# Altium project HPBIController.PrjPCB (part 4 of 8)

## Sheet DDR3A.SchDoc: 02290_Sonoma_Controller
size B; ApprovedBy: J Johnson; CheckedBy: J Johnson; Author: sdfasdfdfAEFfasdFfaF; DrawnBy: J Johnson; Organization: Opsero Electronic Design; Address1: 21-915 Av. Marguerite-Bourgeoys; Address2: Québec (QC); Address3: G1S 3X4; DocumentNumber: OP009-001-SCH; Revision: D-1; SheetNumber: 03; SheetTotal: 16; Tel1: (581) 308-8830; Tel2: (581) 308-8830; Project: 02290_Sonoma_Controller; CheckedDate: 2013-12-13; Sheet: DDR3 SDRAM Page 1; PageSetup: Record=PageOptions|CenterHorizontal=True|CenterVertical=True|PrintScale=1.08|XCorrection=1.00|YCorrection=1.00|PrintKind=0|BorderSize=5000000|LeftOffset=0|BottomOffset=0|Orientation=2|PaperLength=1000|PaperWidth=1000|Scale=100|PaperSource=7|PrintQuality=-4|MediaType=1|DitherType=10|PaperKind=Tabloid     [11 x 17 in]|PrintScaleMode=1; DrawDate: 2013-12-13; SchTitle: 02290_Sonoma_Controller; RevDescription: Replaced Q2,Q3 with STD16NF06LT4; RevDate: 2020-07-07; RevBy: J Johnson; RevDescription2: Added resistors to QSPI interface; ModifiedDate: 2020-07-07
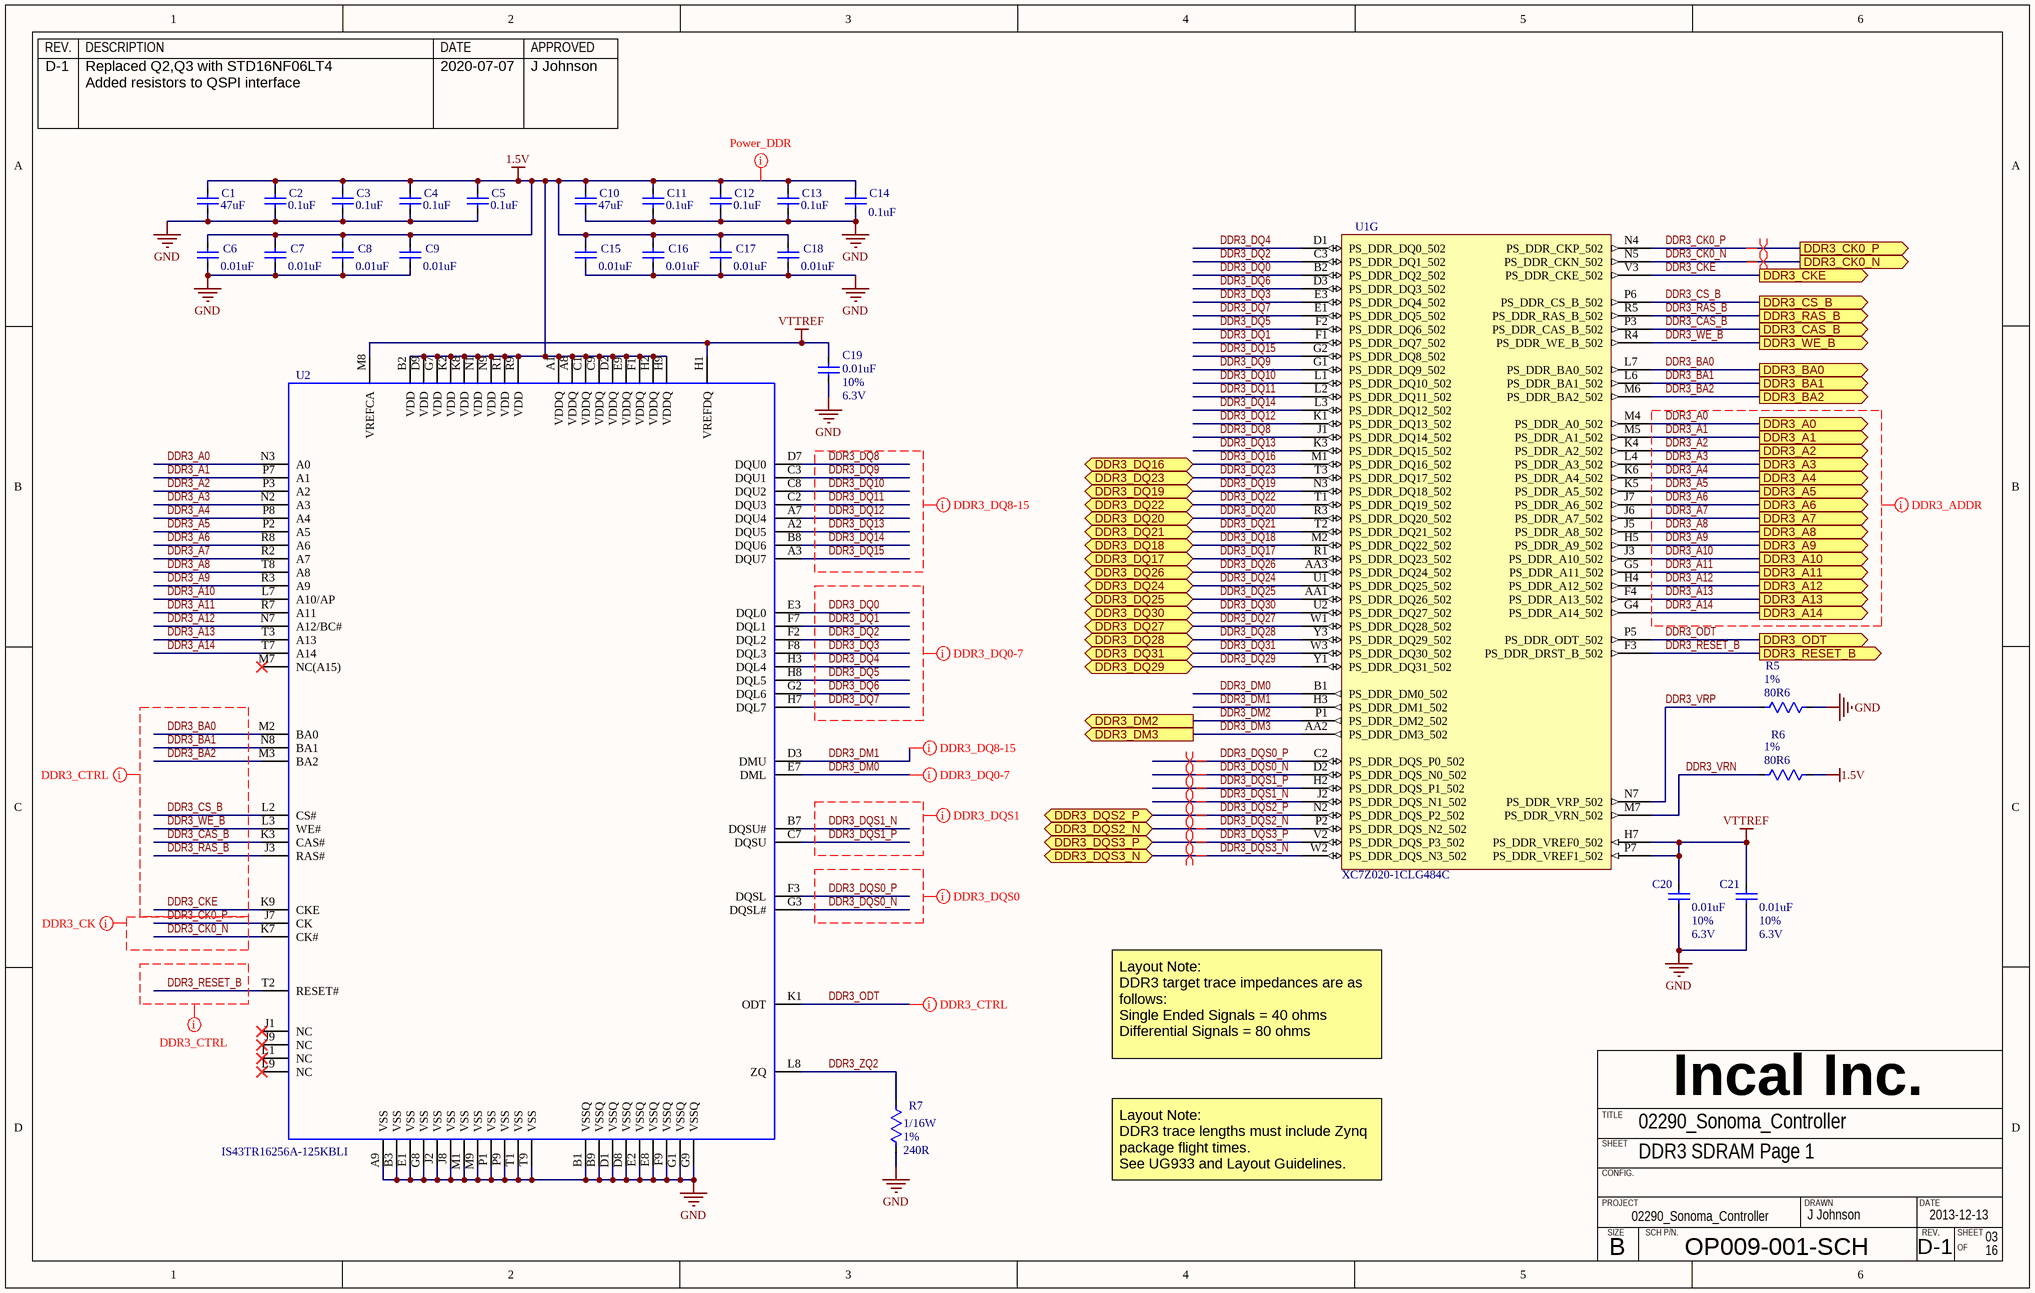
[diagram p5: DDR3A.SchDoc]

### Parts
C1  value 47uF  [CAPC2013X125N]  (hidden comment: CAPACITOR_NP_TYPE1)
C2  value 0.1uF  [CAPC0603X33N]  (hidden comment: CAPACITOR_NP_TYPE1)
C3  value 0.1uF  [CAPC0603X33N]  (hidden comment: CAPACITOR_NP_TYPE1)
C4  value 0.1uF  [CAPC0603X33N]  (hidden comment: CAPACITOR_NP_TYPE1)
C5  value 0.1uF  [CAPC0603X33N]  (hidden comment: CAPACITOR_NP_TYPE1)
C6  value 0.01uF  [CAPC0603X33N]  (hidden comment: CAPACITOR_NP_TYPE1)
C7  value 0.01uF  [CAPC0603X33N]  (hidden comment: CAPACITOR_NP_TYPE1)
C8  value 0.01uF  [CAPC0603X33N]  (hidden comment: CAPACITOR_NP_TYPE1)
C9  value 0.01uF  [CAPC0603X33N]  (hidden comment: CAPACITOR_NP_TYPE1)
C10  value 47uF  [CAPC2013X125N]  (hidden comment: CAPACITOR_NP_TYPE1)
C11  value 0.1uF  [CAPC0603X33N]  (hidden comment: CAPACITOR_NP_TYPE1)
C12  value 0.1uF  [CAPC0603X33N]  (hidden comment: CAPACITOR_NP_TYPE1)
C13  value 0.1uF  [CAPC0603X33N]  (hidden comment: CAPACITOR_NP_TYPE1)
C14  value 0.1uF  [CAPC0603X33N]  (hidden comment: CAPACITOR_NP_TYPE1)
C15  value 0.01uF  [CAPC0603X33N]  (hidden comment: CAPACITOR_NP_TYPE1)
C16  value 0.01uF  [CAPC0603X33N]  (hidden comment: CAPACITOR_NP_TYPE1)
C17  value 0.01uF  [CAPC0603X33N]  (hidden comment: CAPACITOR_NP_TYPE1)
C18  value 0.01uF  [CAPC0603X33N]  (hidden comment: CAPACITOR_NP_TYPE1)
C19  value 0.01uF  Tolerance: 10%  Voltage: 6.3V  [CAPC0603X33N]  (hidden comment: CAPACITOR_NP_TYPE1)
C20  value 0.01uF  Tolerance: 10%  Voltage: 6.3V  [CAPC0603X33N]  (hidden comment: CAPACITOR_NP_TYPE1)
C21  value 0.01uF  Tolerance: 10%  Voltage: 6.3V  [CAPC0603X33N]  (hidden comment: CAPACITOR_NP_TYPE1)
R5  value 80R6  Tolerance: 1%  [RESC1005X33N]  (hidden comment: *)
R6  value 80R6  Tolerance: 1%  [RESC1005X33N]  (hidden comment: *)
R7  value 240R  Power: 1/16W  Tolerance: 1%  [RESC1005X33N]  (hidden comment: *)
U1  XC7Z020-1CLG484C  [CLG484]  (part G of 10)
U2  IS43TR16256A-125KBLI  [BGA96C80P6X16_900X1300X120]

### Ports
DDR3_A0 (out), DDR3_A1 (out), DDR3_A2 (out), DDR3_A3 (out), DDR3_A4 (out), DDR3_A5 (out), DDR3_A6 (out), DDR3_A7 (out), DDR3_A8 (out), DDR3_A9 (out), DDR3_A10 (out), DDR3_A11 (out), DDR3_A12 (out), DDR3_A13 (out), DDR3_A14 (out), DDR3_BA0 (out), DDR3_BA1 (out), DDR3_BA2 (out), DDR3_CAS_B (out), DDR3_CK0_N (out), DDR3_CK0_P (out), DDR3_CKE (out), DDR3_CS_B (out), DDR3_DM2 (out), DDR3_DM3 (out), DDR3_DQ16 (bidir), DDR3_DQ17 (bidir), DDR3_DQ18 (bidir), DDR3_DQ19 (bidir), DDR3_DQ20 (bidir), DDR3_DQ21 (bidir), DDR3_DQ22 (bidir), DDR3_DQ23 (bidir), DDR3_DQ24 (bidir), DDR3_DQ25 (bidir), DDR3_DQ26 (bidir), DDR3_DQ27 (bidir), DDR3_DQ28 (bidir), DDR3_DQ29 (bidir), DDR3_DQ30 (bidir), DDR3_DQ31 (bidir), DDR3_DQS2_N (bidir), DDR3_DQS2_P (bidir), DDR3_DQS3_N (bidir), DDR3_DQS3_P (bidir), DDR3_ODT (out), DDR3_RAS_B (out), DDR3_RESET_B (out), DDR3_WE_B (out)

### Nets
1.5V: C1.1 C2.1 C3.1 C4.1 C5.1 C6.1 C7.1 C8.1 C9.1 C10.1 C11.1 C12.1 C13.1 C14.1 C15.1 C16.1 C17.1 C18.1 R6.1 U2.A1(VDDQ) U2.A8(VDDQ) U2.B2(VDD) U2.C1(VDDQ) U2.C9(VDDQ) U2.D2(VDDQ) U2.D9(VDD) U2.E9(VDDQ) U2.F1(VDDQ) U2.G7(VDD) U2.H2(VDDQ) U2.H9(VDDQ) U2.K2(VDD) U2.K8(VDD) U2.N1(VDD) U2.N9(VDD) U2.R1(VDD) U2.R9(VDD)
GND: C1.2 C2.2 C3.2 C4.2 C5.2 C6.2 C7.2 C8.2 C9.2 C10.2 C11.2 C12.2 C13.2 C14.2 C15.2 C16.2 C17.2 C18.2 C19.2 C20.2 C21.2 R5.2 R7.1 U2.A9(VSS) U2.B1(VSSQ) U2.B3(VSS) U2.B9(VSSQ) U2.D1(VSSQ) U2.D8(VSSQ) U2.E1(VSS) U2.E2(VSSQ) U2.E8(VSSQ) U2.F9(VSSQ) U2.G1(VSSQ) U2.G8(VSS) U2.G9(VSSQ) U2.J2(VSS) U2.J8(VSS) U2.M1(VSS) U2.M9(VSS) U2.P1(VSS) U2.P9(VSS) U2.T1(VSS) U2.T9(VSS)
VTTREF: C19.1 C20.1 C21.1 U1.H7(PS_DDR_VREF0_502) U1.P7(PS_DDR_VREF1_502) U2.H1(VREFDQ) U2.M8(VREFCA)
DDR3_A0: U1.M4(PS_DDR_A0_502) U2.N3(A0) ; port DDR3_A0
DDR3_A1: U1.M5(PS_DDR_A1_502) U2.P7(A1) ; port DDR3_A1
DDR3_A2: U1.K4(PS_DDR_A2_502) U2.P3(A2) ; port DDR3_A2
DDR3_A3: U1.L4(PS_DDR_A3_502) U2.N2(A3) ; port DDR3_A3
DDR3_A4: U1.K6(PS_DDR_A4_502) U2.P8(A4) ; port DDR3_A4
DDR3_A5: U1.K5(PS_DDR_A5_502) U2.P2(A5) ; port DDR3_A5
DDR3_A6: U1.J7(PS_DDR_A6_502) U2.R8(A6) ; port DDR3_A6
DDR3_A7: U1.J6(PS_DDR_A7_502) U2.R2(A7) ; port DDR3_A7
DDR3_A8: U1.J5(PS_DDR_A8_502) U2.T8(A8) ; port DDR3_A8
DDR3_A9: U1.H5(PS_DDR_A9_502) U2.R3(A9) ; port DDR3_A9
DDR3_A10: U1.J3(PS_DDR_A10_502) U2.L7(A10/AP) ; port DDR3_A10
DDR3_A11: U1.G5(PS_DDR_A11_502) U2.R7(A11) ; port DDR3_A11
DDR3_A12: U1.H4(PS_DDR_A12_502) U2.N7(A12/BC#) ; port DDR3_A12
DDR3_A13: U1.F4(PS_DDR_A13_502) U2.T3(A13) ; port DDR3_A13
DDR3_A14: U1.G4(PS_DDR_A14_502) U2.T7(A14) ; port DDR3_A14
DDR3_BA0: U1.L7(PS_DDR_BA0_502) U2.M2(BA0) ; port DDR3_BA0
DDR3_BA1: U1.L6(PS_DDR_BA1_502) U2.N8(BA1) ; port DDR3_BA1
DDR3_BA2: U1.M6(PS_DDR_BA2_502) U2.M3(BA2) ; port DDR3_BA2
DDR3_CAS_B: U1.P3(PS_DDR_CAS_B_502) U2.K3(CAS#) ; port DDR3_CAS_B
DDR3_CK0_N: U1.N5(PS_DDR_CKN_502) U2.K7(CK#) ; port DDR3_CK0_N
DDR3_CK0_P: U1.N4(PS_DDR_CKP_502) U2.J7(CK) ; port DDR3_CK0_P
DDR3_CKE: U1.V3(PS_DDR_CKE_502) U2.K9(CKE) ; port DDR3_CKE
DDR3_CS_B: U1.P6(PS_DDR_CS_B_502) U2.L2(CS#) ; port DDR3_CS_B
DDR3_DM0: U1.B1(PS_DDR_DM0_502) U2.E7(DML)
DDR3_DM1: U1.H3(PS_DDR_DM1_502) U2.D3(DMU)
DDR3_DM2: U1.P1(PS_DDR_DM2_502) ; port DDR3_DM2
DDR3_DM3: U1.AA2(PS_DDR_DM3_502) ; port DDR3_DM3
DDR3_DQ0: U1.B2(PS_DDR_DQ2_502) U2.E3(DQL0)
DDR3_DQ1: U1.F1(PS_DDR_DQ7_502) U2.F7(DQL1)
DDR3_DQ2: U1.C3(PS_DDR_DQ1_502) U2.F2(DQL2)
DDR3_DQ3: U1.E3(PS_DDR_DQ4_502) U2.F8(DQL3)
DDR3_DQ4: U1.D1(PS_DDR_DQ0_502) U2.H3(DQL4)
DDR3_DQ5: U1.F2(PS_DDR_DQ6_502) U2.H8(DQL5)
DDR3_DQ6: U1.D3(PS_DDR_DQ3_502) U2.G2(DQL6)
DDR3_DQ7: U1.E1(PS_DDR_DQ5_502) U2.H7(DQL7)
DDR3_DQ8: U1.J1(PS_DDR_DQ14_502) U2.D7(DQU0)
DDR3_DQ9: U1.G1(PS_DDR_DQ9_502) U2.C3(DQU1)
DDR3_DQ10: U1.L1(PS_DDR_DQ10_502) U2.C8(DQU2)
DDR3_DQ11: U1.L2(PS_DDR_DQ11_502) U2.C2(DQU3)
DDR3_DQ12: U1.K1(PS_DDR_DQ13_502) U2.A7(DQU4)
DDR3_DQ13: U1.K3(PS_DDR_DQ15_502) U2.A2(DQU5)
DDR3_DQ14: U1.L3(PS_DDR_DQ12_502) U2.B8(DQU6)
DDR3_DQ15: U1.G2(PS_DDR_DQ8_502) U2.A3(DQU7)
DDR3_DQ16: U1.M1(PS_DDR_DQ16_502) ; port DDR3_DQ16
DDR3_DQ17: U1.R1(PS_DDR_DQ23_502) ; port DDR3_DQ17
DDR3_DQ18: U1.M2(PS_DDR_DQ22_502) ; port DDR3_DQ18
DDR3_DQ19: U1.N3(PS_DDR_DQ18_502) ; port DDR3_DQ19
DDR3_DQ20: U1.R3(PS_DDR_DQ20_502) ; port DDR3_DQ20
DDR3_DQ21: U1.T2(PS_DDR_DQ21_502) ; port DDR3_DQ21
DDR3_DQ22: U1.T1(PS_DDR_DQ19_502) ; port DDR3_DQ22
DDR3_DQ23: U1.T3(PS_DDR_DQ17_502) ; port DDR3_DQ23
DDR3_DQ24: U1.U1(PS_DDR_DQ25_502) ; port DDR3_DQ24
DDR3_DQ25: U1.AA1(PS_DDR_DQ26_502) ; port DDR3_DQ25
DDR3_DQ26: U1.AA3(PS_DDR_DQ24_502) ; port DDR3_DQ26
DDR3_DQ27: U1.W1(PS_DDR_DQ28_502) ; port DDR3_DQ27
DDR3_DQ28: U1.Y3(PS_DDR_DQ29_502) ; port DDR3_DQ28
DDR3_DQ29: U1.Y1(PS_DDR_DQ31_502) ; port DDR3_DQ29
DDR3_DQ30: U1.U2(PS_DDR_DQ27_502) ; port DDR3_DQ30
DDR3_DQ31: U1.W3(PS_DDR_DQ30_502) ; port DDR3_DQ31
DDR3_DQS0_N: U1.D2(PS_DDR_DQS_N0_502) U2.G3(DQSL#)
DDR3_DQS0_P: U1.C2(PS_DDR_DQS_P0_502) U2.F3(DQSL)
DDR3_DQS1_N: U1.J2(PS_DDR_DQS_N1_502) U2.B7(DQSU#)
DDR3_DQS1_P: U1.H2(PS_DDR_DQS_P1_502) U2.C7(DQSU)
DDR3_DQS2_N: U1.P2(PS_DDR_DQS_N2_502) ; port DDR3_DQS2_N
DDR3_DQS2_P: U1.N2(PS_DDR_DQS_P2_502) ; port DDR3_DQS2_P
DDR3_DQS3_N: U1.W2(PS_DDR_DQS_N3_502) ; port DDR3_DQS3_N
DDR3_DQS3_P: U1.V2(PS_DDR_DQS_P3_502) ; port DDR3_DQS3_P
DDR3_ODT: U1.P5(PS_DDR_ODT_502) U2.K1(ODT) ; port DDR3_ODT
DDR3_RAS_B: U1.R5(PS_DDR_RAS_B_502) U2.J3(RAS#) ; port DDR3_RAS_B
DDR3_RESET_B: U1.F3(PS_DDR_DRST_B_502) U2.T2(RESET#) ; port DDR3_RESET_B
DDR3_VRN: R6.2 U1.M7(PS_DDR_VRN_502)
DDR3_VRP: R5.1 U1.N7(PS_DDR_VRP_502)
DDR3_WE_B: U1.R4(PS_DDR_WE_B_502) U2.L3(WE#) ; port DDR3_WE_B
DDR3_ZQ2: R7.2 U2.L8(ZQ)

Not connected (* = marked no-connect by the designer): U2 J1(NC)* J9(NC)* L1(NC)* L9(NC)* M7(NC(A15))*

### Layout directives
differential pair: DDR3_CK0_N, DDR3_CK0_P, DDR3_DQS0_N, DDR3_DQS0_P, DDR3_DQS1_N, DDR3_DQS1_P, DDR3_DQS2_N, DDR3_DQS2_P, DDR3_DQS3_N, DDR3_DQS3_P
net class DDR3_CNTRL: DDR3_BA0, DDR3_BA1, DDR3_BA2, DDR3_CAS_B, DDR3_CKE, DDR3_CS_B, DDR3_ODT, DDR3_RAS_B, DDR3_RESET_B, DDR3_WE_B
net class DDR3_CK: DDR3_CK0_N, DDR3_CK0_P
net class DDR3_DQ1(8-15): DDR3_DM1, DDR3_DQ8, DDR3_DQ9, DDR3_DQ10, DDR3_DQ11, DDR3_DQ12, DDR3_DQ13, DDR3_DQ14, DDR3_DQ15
net class DDR3_DQ0(0-7): DDR3_DM0, DDR3_DQ0, DDR3_DQ1, DDR3_DQ2, DDR3_DQ3, DDR3_DQ4, DDR3_DQ5, DDR3_DQ6, DDR3_DQ7
net class DDR3_DQS1: DDR3_DQS1_N, DDR3_DQS1_P
net class DDR3_DQS0: DDR3_DQS0_N, DDR3_DQS0_P
net class Power_DDR: 1.5V
net class DDR3_ADDR: DDR3_A0, DDR3_A1, DDR3_A2, DDR3_A3, DDR3_A4, DDR3_A5, DDR3_A6, DDR3_A7, DDR3_A8, DDR3_A9, DDR3_A10, DDR3_A11, DDR3_A12, DDR3_A13, DDR3_A14

### Notes on the sheet
- Layout Note:
  DDR3 target trace impedances are as follows:
  Single Ended Signals = 40 ohms
  Differential Signals = 80 ohms
- Layout Note:
  DDR3 trace lengths must include Zynq package flight times.
  See UG933 and Layout Guidelines.
- REV.
- DESCRIPTION
- DATE
- APPROVED
- Incal Inc.
- SHEET
- TITLE
- CONFIG.
- PROJECT
- SIZE
- SCH P/N.
- DRAWN
- B
- OF

### Library data of the parts
C1 C10 = C0805_47uF_10%_25V_X5R: Capacitor ceramic, X5R, 47uF, 6.3V, 20%, -55 to +85 C,; Manufacturer 1: Taiyo; Mfg Part Number 1: JMK212BJ476MG-T; EIA(I) Package: 0805; EIA(M) Package: 2012; ASSY: USED; Status: Active; Power: *; Current: *; Part Ref: C0805_47uF_10%_25V_X5R; Comment_1: *; RoHs: True; Tolerance: 20%; Voltage: 6.3V; Operating Temp: -55 to +85 C
C2-C5 C11-C14 = C0201_0.1uF_10%_6.3V_X5R: Capacitor ceramic, X5R, 0.1uF, 6.3V, 10%, -55 to +125 C, EIA0201; Manufacturer 1: Murata; Mfg Part Number 1: GRM033R60J104KE19D; EIA(I) Package: 0201; EIA(M) Package: 0603; ASSY: USED; Status: Active; Power: *; Current: *; Part Ref: C0201_0.1uF_10%_6.3V_X5R; Comment_1: *; RoHs: True; Tolerance: 10%; Voltage: 6.3V; Operating Temp: -55 to +85 C
C6-C9 C15-C21 = C0201_0.01uF_10%_6.3V_X5R: Capacitor ceramic, X5R, 0.01uF, 6.3V, 10%, -55 to +125 C, EIA0201; Manufacturer 1: Murata; Mfg Part Number 1: GRM033R60J103KA01D; EIA(I) Package: 0201; EIA(M) Package: 0603; ASSY: USED; Status: Active; Power: *; Current: *; Part Ref: C0201_0.01uF_10%_6.3V_X5R; Comment_1: *; RoHs: True; Operating Temp: -55 to +85 C
  C6-C9 C15-C18: Tolerance: 10%; Voltage: 6.3V
R5 R6 = R0402_80R6_1%: Resistor, 80R6, 1/16W, 1%, -50 to +155 C, EIA0402, EIA(M)1005; Manufacturer 1: Yageo; Mfg Part Number 1: RC0402FR-0780R6L; EIA(I) Package: 0402; EIA(M) Package: 1005; Voltage: 50V; ASSY: USED; Status: Active; Part Ref: R0402_80R6_1%; Current: *; Comment_1: *; RoHs: True; Power: 1/16W; Operating Temp: -50 to +155 C; Datasheet 1: ..\datasheet\Resistor\Yaego\Thick_Film\RC0402\2012-03-29; Manufacturer 2: Vishay Dale; Mfg Part Number 2: CRCW040280R6FKED; Datasheet 2: ..\datasheet\Resistor\Vishay Dale\CRC\2012-03-29
R7 = R0402_240R_1%: Resistor, 240R, 1/16W, 1%, -50 to +155 C, EIA0402, EIA(M)1005; Manufacturer 1: Vishay Dale; Mfg Part Number 1: CRCW0402240RFKED; EIA(I) Package: 0402; EIA(M) Package: 1005; Voltage: 50V; ASSY: USED; Status: Active; Part Ref: R0402_240R_1%; Current: *; Comment_1: *; RoHs: True; Operating Temp: -50 to +155 C
U1 = XC7Z020-1CLG484C: 667 MHz Zynq™-7000 AP SoC, 130 PS I/O, 200 FPGA I/O, 484-Ball BGA, Speed Grade 1, Commercial Grade; Manufacturer: Xilinx; Extensible Block RAM (# 36Kb Blocks): 560 KB (140); Flip Flops: 106400; LUTs: 53200; Speed Grade: -1; DatasheetVersion: v1.2; PackageVersion: Rev 1.1; PackageReference: CLG484; PackageDescription: Wire-Bond Chip-Scale BGA, Body 19 x 19 mm, 0.8 mm Pitch; Generic Part Number: XC7Z020; RoHS: True; Mounting Technology: Surface Mount; Code_JEDEC: MO-275-PPAA-2; PartNumber: XC7Z020-1CLG484C; ComponentLink1Description: Datasheet; ComponentLink1URL: http://www.xilinx.com/support/documentation/data_sheets/ds190-Zynq-7000-Overview.pdf; ComponentLink2Description: Package Specification; ComponentLink2URL: http://www.xilinx.com/support/documentation/user_guides/ug865-Zynq-7000-Pkg-Pinout.pdf; ComponentLink3Description: DC and AC Switching Characteristics; ComponentLink3URL: http://www.xilinx.com/support/documentation/data_sheets/ds187-XC7Z010-XC7Z020-Data-Sheet.pdf; ComponentLink4Description: Package File; ComponentLink4URL: http://www.xilinx.com/support/packagefiles/z7packages/xc7z020clg484pkg.txt; ComponentLink5Description: Packaging and Pinout; ComponentLink5URL: http://www.xilinx.com/support/documentation/user_guides/ug865-Zynq-7000-Pkg-Pinout.pdf; ComponentLink6Description: PCB and Layout Guide; ComponentLink6URL: http://www.xilinx.com/support/documentation/user_guides/ug483_7Series_PCB.pdf; Part Ref: XC7Z020-1CLG484C; Status: Active; Value: XC7Z020-1CLG484C; Manufacturer 1: Xilinx; Mfg Part Number 1: XC7Z020-1CLG484C; Package: CLG484
U2 = IS43TR16256A-125KBLI: DDR3 SDRAM, 512Mx8, 256Mx16 4Gb; Manufacturer 1: ISSI; PART NUMBER: IS43TR16256A-125KBLI; Part Ref: IS43TR16256A-125KBLI; Status: Active; RoHs: False; Value: IS43TR16256A-125KBLI; Mfg Part Number 1: IS43TR16256A-125KBLI

## Sheet DDR3B.SchDoc: 02290_Sonoma_Controller
size B; ApprovedBy: J Johnson; CheckedBy: J Johnson; Author: sdfasdfdfAEFfasdFfaF; DrawnBy: J Johnson; Organization: Opsero Electronic Design; Address1: 21-915 Av. Marguerite-Bourgeoys; Address2: Québec (QC); Address3: G1S 3X4; DocumentNumber: OP009-001-SCH; Revision: D-1; SheetNumber: 04; SheetTotal: 16; Tel1: (581) 308-8830; Tel2: (581) 308-8830; Project: 02290_Sonoma_Controller; CheckedDate: 2013-12-13; Sheet: DDR3 SDRAM Page 2; PageSetup: Record=PageOptions|CenterHorizontal=True|CenterVertical=True|PrintScale=1.08|XCorrection=1.00|YCorrection=1.00|PrintKind=0|BorderSize=5000000|LeftOffset=0|BottomOffset=0|Orientation=2|PaperLength=1000|PaperWidth=1000|Scale=100|PaperSource=7|PrintQuality=-4|MediaType=1|DitherType=10|PaperKind=Tabloid     [11 x 17 in]|PrintScaleMode=1; DrawDate: 2013-12-13; SchTitle: 02290_Sonoma_Controller; RevDescription: Replaced Q2,Q3 with STD16NF06LT4; RevDate: 2020-07-07; RevBy: J Johnson; RevDescription2: Added resistors to QSPI interface; ModifiedDate: 2020-07-07
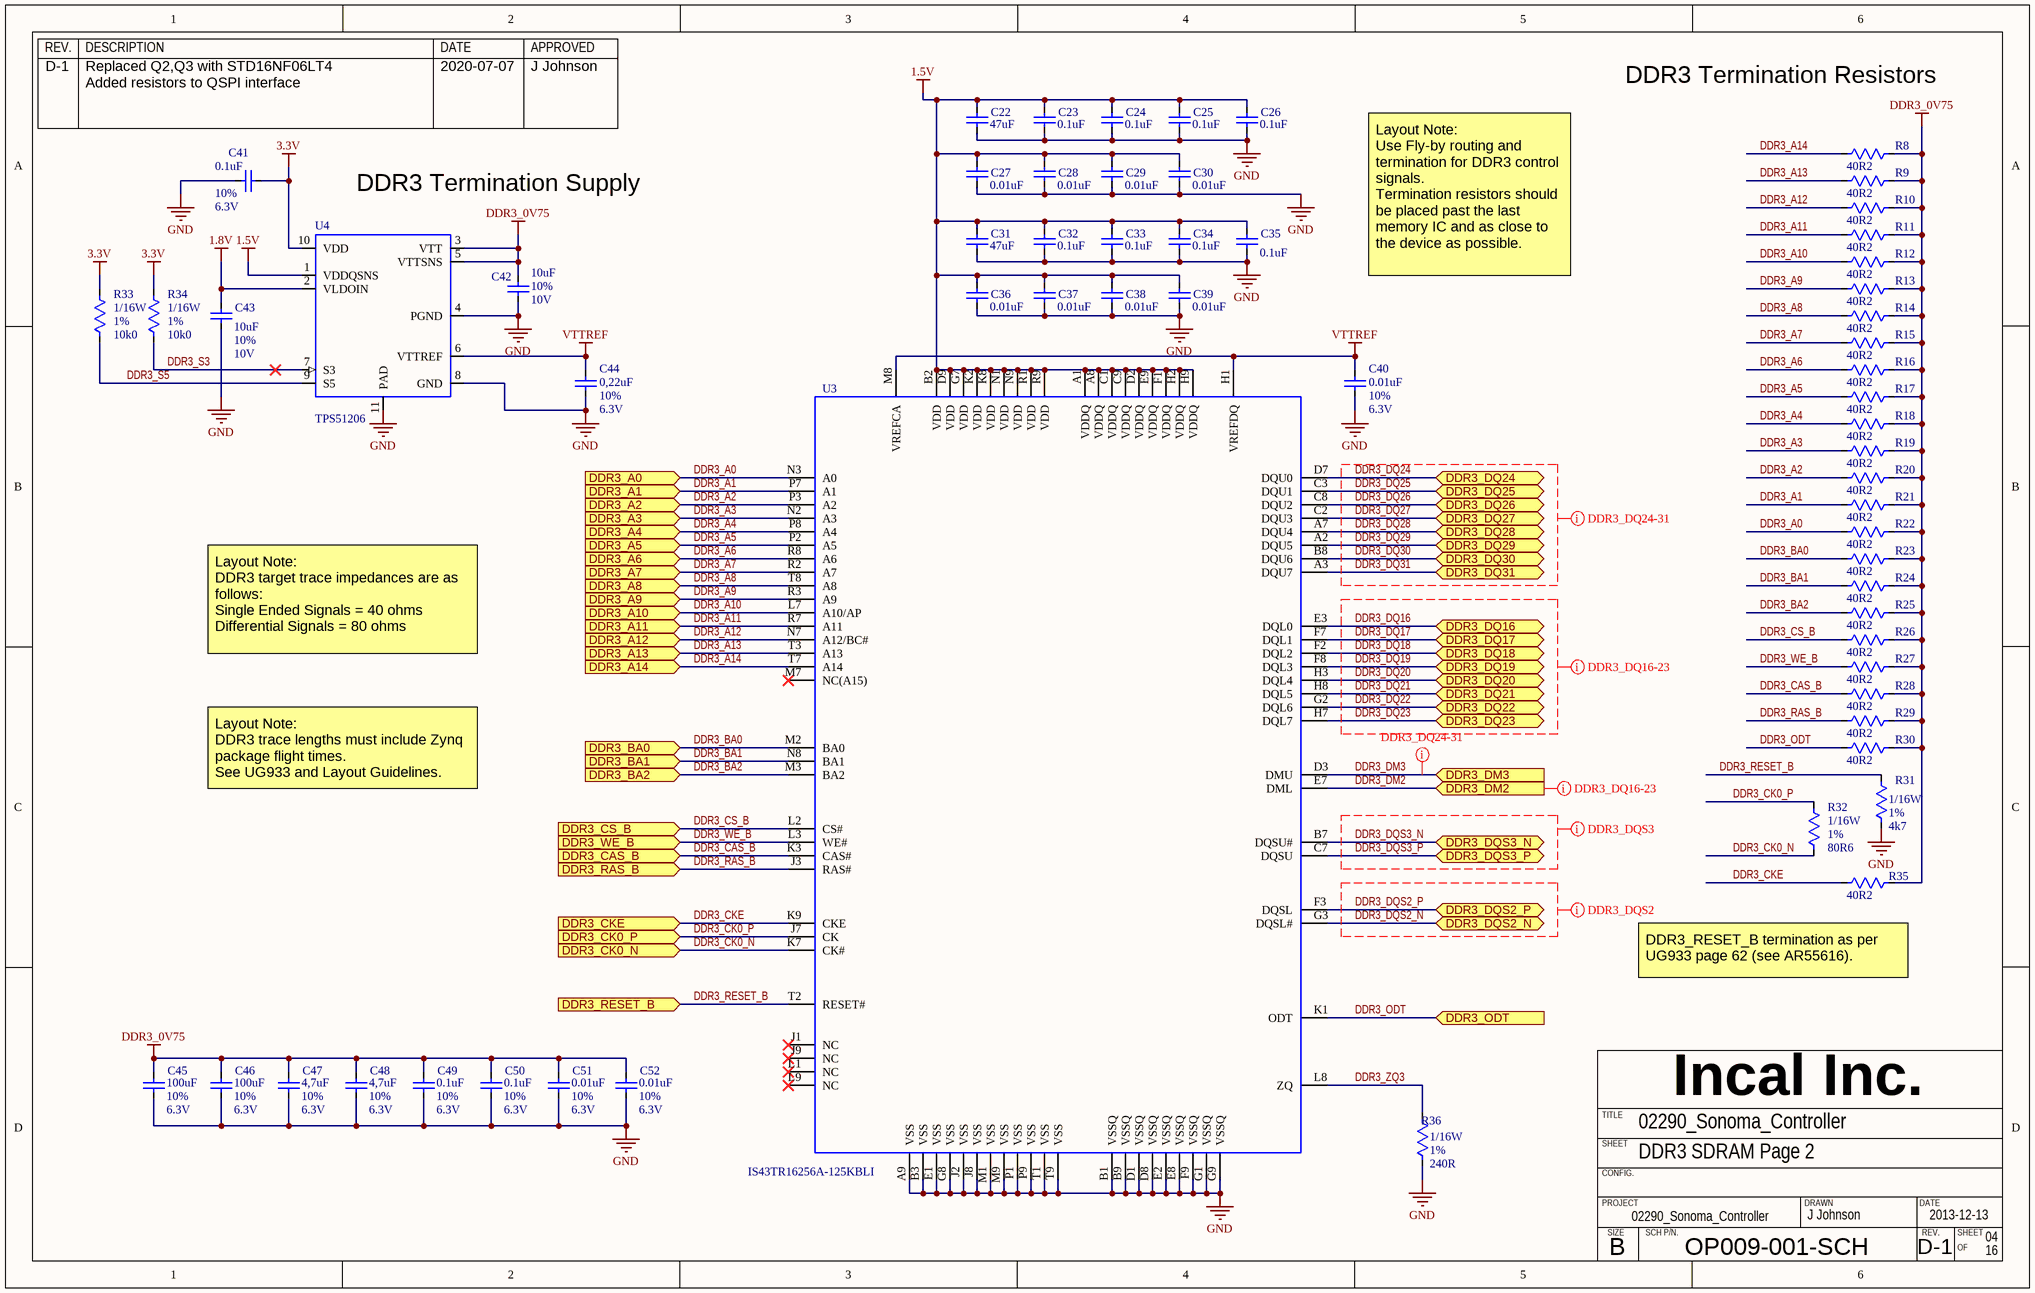
[diagram p6: DDR3B.SchDoc]

### Parts
C22  value 47uF  [CAPC2013X125N]  (hidden comment: CAPACITOR_NP_TYPE1)
C23  value 0.1uF  [CAPC0603X33N]  (hidden comment: CAPACITOR_NP_TYPE1)
C24  value 0.1uF  [CAPC0603X33N]  (hidden comment: CAPACITOR_NP_TYPE1)
C25  value 0.1uF  [CAPC0603X33N]  (hidden comment: CAPACITOR_NP_TYPE1)
C26  value 0.1uF  [CAPC0603X33N]  (hidden comment: CAPACITOR_NP_TYPE1)
C27  value 0.01uF  [CAPC0603X33N]  (hidden comment: CAPACITOR_NP_TYPE1)
C28  value 0.01uF  [CAPC0603X33N]  (hidden comment: CAPACITOR_NP_TYPE1)
C29  value 0.01uF  [CAPC0603X33N]  (hidden comment: CAPACITOR_NP_TYPE1)
C30  value 0.01uF  [CAPC0603X33N]  (hidden comment: CAPACITOR_NP_TYPE1)
C31  value 47uF  [CAPC2013X125N]  (hidden comment: CAPACITOR_NP_TYPE1)
C32  value 0.1uF  [CAPC0603X33N]  (hidden comment: CAPACITOR_NP_TYPE1)
C33  value 0.1uF  [CAPC0603X33N]  (hidden comment: CAPACITOR_NP_TYPE1)
C34  value 0.1uF  [CAPC0603X33N]  (hidden comment: CAPACITOR_NP_TYPE1)
C35  value 0.1uF  [CAPC0603X33N]  (hidden comment: CAPACITOR_NP_TYPE1)
C36  value 0.01uF  [CAPC0603X33N]  (hidden comment: CAPACITOR_NP_TYPE1)
C37  value 0.01uF  [CAPC0603X33N]  (hidden comment: CAPACITOR_NP_TYPE1)
C38  value 0.01uF  [CAPC0603X33N]  (hidden comment: CAPACITOR_NP_TYPE1)
C39  value 0.01uF  [CAPC0603X33N]  (hidden comment: CAPACITOR_NP_TYPE1)
C40  value 0.01uF  Tolerance: 10%  Voltage: 6.3V  [CAPC0603X33N]  (hidden comment: CAPACITOR_NP_TYPE1)
C41  value 0.1uF  Tolerance: 10%  Voltage: 6.3V  [CAPC0603X33N]  (hidden comment: CAPACITOR_NP_TYPE1)
C42  value 10uF  Tolerance: 10%  Voltage: 10V  [CAPC1608X38N]  (hidden comment: CAPACITOR_NP_TYPE1)
C43  value 10uF  Tolerance: 10%  Voltage: 10V  [CAPC1608X38N]  (hidden comment: CAPACITOR_NP_TYPE1)
C44  value 0,22uF  Tolerance: 10%  Voltage: 6.3V  [CAPC1005X55N]  (hidden comment: CAPACITOR_NP_TYPE1)
C45  value 100uF  Tolerance: 10%  Voltage: 6.3V  [CAPC3225X250N]  (hidden comment: CAPACITOR_NP_TYPE1)
C46  value 100uF  Tolerance: 10%  Voltage: 6.3V  [CAPC3225X250N]  (hidden comment: CAPACITOR_NP_TYPE1)
C47  value 4,7uF  Tolerance: 10%  Voltage: 6.3V  [CAPC1005X33N]  (hidden comment: CAPACITOR_NP_TYPE1)
C48  value 4,7uF  Tolerance: 10%  Voltage: 6.3V  [CAPC1005X33N]  (hidden comment: CAPACITOR_NP_TYPE1)
C49  value 0.1uF  Tolerance: 10%  Voltage: 6.3V  [CAPC0603X33N]  (hidden comment: CAPACITOR_NP_TYPE1)
C50  value 0.1uF  Tolerance: 10%  Voltage: 6.3V  [CAPC0603X33N]  (hidden comment: CAPACITOR_NP_TYPE1)
C51  value 0.01uF  Tolerance: 10%  Voltage: 6.3V  [CAPC0603X33N]  (hidden comment: CAPACITOR_NP_TYPE1)
C52  value 0.01uF  Tolerance: 10%  Voltage: 6.3V  [CAPC0603X33N]  (hidden comment: CAPACITOR_NP_TYPE1)
R8  value 40R2  [RESC1005X33N]  (hidden comment: *)
R9  value 40R2  [RESC1005X33N]  (hidden comment: *)
R10  value 40R2  [RESC1005X33N]  (hidden comment: *)
R11  value 40R2  [RESC1005X33N]  (hidden comment: *)
R12  value 40R2  [RESC1005X33N]  (hidden comment: *)
R13  value 40R2  [RESC1005X33N]  (hidden comment: *)
R14  value 40R2  [RESC1005X33N]  (hidden comment: *)
R15  value 40R2  [RESC1005X33N]  (hidden comment: *)
R16  value 40R2  [RESC1005X33N]  (hidden comment: *)
R17  value 40R2  [RESC1005X33N]  (hidden comment: *)
R18  value 40R2  [RESC1005X33N]  (hidden comment: *)
R19  value 40R2  [RESC1005X33N]  (hidden comment: *)
R20  value 40R2  [RESC1005X33N]  (hidden comment: *)
R21  value 40R2  [RESC1005X33N]  (hidden comment: *)
R22  value 40R2  [RESC1005X33N]  (hidden comment: *)
R23  value 40R2  [RESC1005X33N]  (hidden comment: *)
R24  value 40R2  [RESC1005X33N]  (hidden comment: *)
R25  value 40R2  [RESC1005X33N]  (hidden comment: *)
R26  value 40R2  [RESC1005X33N]  (hidden comment: *)
R27  value 40R2  [RESC1005X33N]  (hidden comment: *)
R28  value 40R2  [RESC1005X33N]  (hidden comment: *)
R29  value 40R2  [RESC1005X33N]  (hidden comment: *)
R30  value 40R2  [RESC1005X33N]  (hidden comment: *)
R31  value 4k7  Power: 1/16W  Tolerance: 1%  [RESC1005X33N]  (hidden comment: *)
R32  value 80R6  Power: 1/16W  Tolerance: 1%  [RESC1005X33N]  (hidden comment: *)
R33  value 10k0  Power: 1/16W  Tolerance: 1%  [RESC1005X33N]  (hidden comment: *)
R34  value 10k0  Power: 1/16W  Tolerance: 1%  [RESC1005X33N]  (hidden comment: *)
R35  value 40R2  [RESC1005X33N]  (hidden comment: *)
R36  value 240R  Power: 1/16W  Tolerance: 1%  [RESC1005X33N]  (hidden comment: *)
U3  IS43TR16256A-125KBLI  [BGA96C80P6X16_900X1300X120]
U4  TPS51206  [DFN40P200X200X75-11N]

### Ports
DDR3_A0 (in), DDR3_A1 (in), DDR3_A2 (in), DDR3_A3 (in), DDR3_A4 (in), DDR3_A5 (in), DDR3_A6 (in), DDR3_A7 (in), DDR3_A8 (in), DDR3_A9 (in), DDR3_A10 (in), DDR3_A11 (in), DDR3_A12 (in), DDR3_A13 (in), DDR3_A14 (in), DDR3_BA0 (in), DDR3_BA1 (in), DDR3_BA2 (in), DDR3_CAS_B (in), DDR3_CK0_N (in), DDR3_CK0_P (in), DDR3_CKE (in), DDR3_CS_B (in), DDR3_DM2 (in), DDR3_DM3 (in), DDR3_DQ16 (bidir), DDR3_DQ17 (bidir), DDR3_DQ18 (bidir), DDR3_DQ19 (bidir), DDR3_DQ20 (bidir), DDR3_DQ21 (bidir), DDR3_DQ22 (bidir), DDR3_DQ23 (bidir), DDR3_DQ24 (bidir), DDR3_DQ25 (bidir), DDR3_DQ26 (bidir), DDR3_DQ27 (bidir), DDR3_DQ28 (bidir), DDR3_DQ29 (bidir), DDR3_DQ30 (bidir), DDR3_DQ31 (bidir), DDR3_DQS2_N (bidir), DDR3_DQS2_P (bidir), DDR3_DQS3_N (bidir), DDR3_DQS3_P (bidir), DDR3_ODT (in), DDR3_RAS_B (in), DDR3_RESET_B (in), DDR3_WE_B (in)

### Nets
1.5V: C22.1 C23.1 C24.1 C25.1 C26.1 C27.1 C28.1 C29.1 C30.1 C31.1 C32.1 C33.1 C34.1 C35.1 C36.1 C37.1 C38.1 C39.1 U3.A1(VDDQ) U3.A8(VDDQ) U3.B2(VDD) U3.C1(VDDQ) U3.C9(VDDQ) U3.D2(VDDQ) U3.D9(VDD) U3.E9(VDDQ) U3.F1(VDDQ) U3.G7(VDD) U3.H2(VDDQ) U3.H9(VDDQ) U3.K2(VDD) U3.K8(VDD) U3.N1(VDD) U3.N9(VDD) U3.R1(VDD) U3.R9(VDD) U4.1(VDDQSNS)
1.8V: C43.1 U4.2(VLDOIN)
3.3V: C41.1 R33.1 R34.1 U4.10(VDD)
DDR3_0V75: C42.1 C45.1 C46.1 C47.1 C48.1 C49.1 C50.1 C51.1 C52.1 R8.1 R9.1 R10.1 R11.1 R12.1 R13.1 R14.1 R15.1 R16.1 R17.1 R18.1 R19.1 R20.1 R21.1 R22.1 R23.1 R24.1 R25.1 R26.1 R27.1 R28.1 R29.1 R30.1 R35.1 U4.3(VTT) U4.5(VTTSNS)
GND: C22.2 C23.2 C24.2 C25.2 C26.2 C27.2 C28.2 C29.2 C30.2 C31.2 C32.2 C33.2 C34.2 C35.2 C36.2 C37.2 C38.2 C39.2 C40.2 C41.2 C42.2 C43.2 C44.2 C45.2 C46.2 C47.2 C48.2 C49.2 C50.2 C51.2 C52.2 R31.2 R36.1 U3.A9(VSS) U3.B1(VSSQ) U3.B3(VSS) U3.B9(VSSQ) U3.D1(VSSQ) U3.D8(VSSQ) U3.E1(VSS) U3.E2(VSSQ) U3.E8(VSSQ) U3.F9(VSSQ) U3.G1(VSSQ) U3.G8(VSS) U3.G9(VSSQ) U3.J2(VSS) U3.J8(VSS) U3.M1(VSS) U3.M9(VSS) U3.P1(VSS) U3.P9(VSS) U3.T1(VSS) U3.T9(VSS) U4.4(PGND) U4.8(GND) U4.11(PAD)
VTTREF: C40.1 C44.1 U3.H1(VREFDQ) U3.M8(VREFCA) U4.6(VTTREF)
DDR3_A0: R22.2 U3.N3(A0) ; port DDR3_A0
DDR3_A1: R21.2 U3.P7(A1) ; port DDR3_A1
DDR3_A2: R20.2 U3.P3(A2) ; port DDR3_A2
DDR3_A3: R19.2 U3.N2(A3) ; port DDR3_A3
DDR3_A4: R18.2 U3.P8(A4) ; port DDR3_A4
DDR3_A5: R17.2 U3.P2(A5) ; port DDR3_A5
DDR3_A6: R16.2 U3.R8(A6) ; port DDR3_A6
DDR3_A7: R15.2 U3.R2(A7) ; port DDR3_A7
DDR3_A8: R14.2 U3.T8(A8) ; port DDR3_A8
DDR3_A9: R13.2 U3.R3(A9) ; port DDR3_A9
DDR3_A10: R12.2 U3.L7(A10/AP) ; port DDR3_A10
DDR3_A11: R11.2 U3.R7(A11) ; port DDR3_A11
DDR3_A12: R10.2 U3.N7(A12/BC#) ; port DDR3_A12
DDR3_A13: R9.2 U3.T3(A13) ; port DDR3_A13
DDR3_A14: R8.2 U3.T7(A14) ; port DDR3_A14
DDR3_BA0: R23.2 U3.M2(BA0) ; port DDR3_BA0
DDR3_BA1: R24.2 U3.N8(BA1) ; port DDR3_BA1
DDR3_BA2: R25.2 U3.M3(BA2) ; port DDR3_BA2
DDR3_CAS_B: R28.2 U3.K3(CAS#) ; port DDR3_CAS_B
DDR3_CK0_N: R32.1 U3.K7(CK#) ; port DDR3_CK0_N
DDR3_CK0_P: R32.2 U3.J7(CK) ; port DDR3_CK0_P
DDR3_CKE: R35.2 U3.K9(CKE) ; port DDR3_CKE
DDR3_CS_B: R26.2 U3.L2(CS#) ; port DDR3_CS_B
DDR3_DM2: U3.E7(DML) ; port DDR3_DM2
DDR3_DM3: U3.D3(DMU) ; port DDR3_DM3
DDR3_DQ16: U3.E3(DQL0) ; port DDR3_DQ16
DDR3_DQ17: U3.F7(DQL1) ; port DDR3_DQ17
DDR3_DQ18: U3.F2(DQL2) ; port DDR3_DQ18
DDR3_DQ19: U3.F8(DQL3) ; port DDR3_DQ19
DDR3_DQ20: U3.H3(DQL4) ; port DDR3_DQ20
DDR3_DQ21: U3.H8(DQL5) ; port DDR3_DQ21
DDR3_DQ22: U3.G2(DQL6) ; port DDR3_DQ22
DDR3_DQ23: U3.H7(DQL7) ; port DDR3_DQ23
DDR3_DQ24: U3.D7(DQU0) ; port DDR3_DQ24
DDR3_DQ25: U3.C3(DQU1) ; port DDR3_DQ25
DDR3_DQ26: U3.C8(DQU2) ; port DDR3_DQ26
DDR3_DQ27: U3.C2(DQU3) ; port DDR3_DQ27
DDR3_DQ28: U3.A7(DQU4) ; port DDR3_DQ28
DDR3_DQ29: U3.A2(DQU5) ; port DDR3_DQ29
DDR3_DQ30: U3.B8(DQU6) ; port DDR3_DQ30
DDR3_DQ31: U3.A3(DQU7) ; port DDR3_DQ31
DDR3_DQS2_N: U3.G3(DQSL#) ; port DDR3_DQS2_N
DDR3_DQS2_P: U3.F3(DQSL) ; port DDR3_DQS2_P
DDR3_DQS3_N: U3.B7(DQSU#) ; port DDR3_DQS3_N
DDR3_DQS3_P: U3.C7(DQSU) ; port DDR3_DQS3_P
DDR3_ODT: R30.2 U3.K1(ODT) ; port DDR3_ODT
DDR3_RAS_B: R29.2 U3.J3(RAS#) ; port DDR3_RAS_B
DDR3_RESET_B: R31.1 U3.T2(RESET#) ; port DDR3_RESET_B
DDR3_S3: R34.2 U4.7(S3)
DDR3_S5: R33.2 U4.9(S5)
DDR3_WE_B: R27.2 U3.L3(WE#) ; port DDR3_WE_B
DDR3_ZQ3: R36.2 U3.L8(ZQ)

Not connected (* = marked no-connect by the designer): U3 J1(NC)* J9(NC)* L1(NC)* L9(NC)* M7(NC(A15))*

### Layout directives
net class DDR3_DQ3(24-31): DDR3_DM3, DDR3_DQ24, DDR3_DQ25, DDR3_DQ26, DDR3_DQ27, DDR3_DQ28, DDR3_DQ29, DDR3_DQ30, DDR3_DQ31
net class DDR3_DQ2(16-23): DDR3_DM2, DDR3_DQ16, DDR3_DQ17, DDR3_DQ18, DDR3_DQ19, DDR3_DQ20, DDR3_DQ21, DDR3_DQ22, DDR3_DQ23
net class DDR3_DQS3: DDR3_DQS3_N, DDR3_DQS3_P
net class DDR3_DQS2: DDR3_DQS2_N, DDR3_DQS2_P

### Notes on the sheet
- DDR3 Termination Resistors
- (near U4) DDR3 Termination Supply
- Layout Note:
  Use Fly-by routing and termination for DDR3 control signals.
  Termination resistors should be placed past the last memory IC and as close to the device as possible.
- Layout Note:
  DDR3 target trace impedances are as follows:
  Single Ended Signals = 40 ohms
  Differential Signals = 80 ohms
- Layout Note:
  DDR3 trace lengths must include Zynq package flight times.
  See UG933 and Layout Guidelines.
- (near R35) DDR3_RESET_B termination as per UG933 page 62 (see AR55616).
- REV.
- DESCRIPTION
- DATE
- APPROVED
- Incal Inc.
- SHEET
- TITLE
- CONFIG.
- PROJECT
- SIZE
- SCH P/N.
- DRAWN
- B
- OF

### Library data of the parts
C22 C31 = C0805_47uF_10%_25V_X5R: as C1 on sheet DDR3A; Status: Active; Power: *; Current: *; Part Ref: C0805_47uF_10%_25V_X5R; Comment_1: *; RoHs: True; Tolerance: 20%; Voltage: 6.3V; Operating Temp: -55 to +85 C
C23-C26 C32-C35 C41 C49 C50 = C0201_0.1uF_10%_6.3V_X5R: as C2-C5 on sheet DDR3A; Status: Active; Power: *; Current: *; Part Ref: C0201_0.1uF_10%_6.3V_X5R; Comment_1: *; RoHs: True; Operating Temp: -55 to +85 C
  C23-C26 C32-C35: Tolerance: 10%; Voltage: 6.3V
C27-C30 C36-C40 C51 C52 = C0201_0.01uF_10%_6.3V_X5R: as C6 on sheet DDR3A; Status: Active; Power: *; Current: *; Part Ref: C0201_0.01uF_10%_6.3V_X5R; Comment_1: *; RoHs: True; Operating Temp: -55 to +85 C
  C27-C30 C36-C39: Tolerance: 10%; Voltage: 6.3V
C42 C43 = C0603_10uF_10%_10V_X5R: Capacitor ceramic, X5R, 10uF, 10V, 10%, -55 to +85 C, EIA0603; Manufacturer 1: TDK Corporation; Mfg Part Number 1: C1608X5R1A106K080AC; EIA(I) Package: 0603; EIA(M) Package: 1608; ASSY: USED; Status: Active; Power: *; Current: *; Part Ref: C0603_10uF_10%_10V_X5R; Comment_1: *; RoHs: True; Operating Temp: -55 to +85 C
C44 = C0402_0.22uF_10%_6.3V_X5R: Capacitor ceramic, X5R, 0.22uF, 6.3V, 10%, -55 to +85 C, EIA0402; Manufacturer 1: AVX; Mfg Part Number 1: 04026D224KAT2A; EIA(I) Package: 0402; EIA(M) Package: 1005; ASSY: USED; Status: Active; Power: *; Current: *; Part Ref: C0402_0.22uF_10%_6.3V_X5R; Comment_1: *; RoHs: True; Operating Temp: -55 to +85 C
C45 C46 = C1210_100uF_10%_6.3V_X5R: Capacitor ceramic, X5R, 100uF, 6.3V, 10%, -55 to +85 C, EIA1210; Manufacturer 1: Murata; Mfg Part Number 1: GRM32EF50J107ZE20K; EIA(I) Package: 1210; EIA(M) Package: 3225; ASSY: USED; Status: Active; Power: *; Current: *; Part Ref: C1210_100uF_10%_6.3V_X5R; Comment_1: *; RoHs: True; Operating Temp: -55 to +85 C; Datasheet 1: ..\datasheet\Capacitor\Murata\GRM_Serie\GRM32ER60J_X5R\2012-10-25
C47 C48 = C0402_4.7uF_20%_6.3V_X7R: Capacitor ceramic, X5R, 4,7uF, 6.3V, 10%, -55 to +85 C, EIA0402; Manufacturer 1: TDK; Mfg Part Number 1: C1005X5R0J475K; EIA(I) Package: 0402; EIA(M) Package: 1005; ASSY: USED; Status: Active; Power: *; Current: *; Part Ref: C0402_4.7uF_20%_6.3V_X7R; Comment_1: *; RoHs: True; Operating Temp: -55 to +85 C; Datasheet 1: ..\datasheet\Capacitor\TDK\C Series\2012-10-25
R8-R30 R35 = R0402_40R2_1%: Resistor, 40R2, 1/16W, 1%, -50 to +155 C, EIA0402, EIA(M)1005; Manufacturer 1: Yageo; Mfg Part Number 1: RC0402FR-0740R2L; EIA(I) Package: 0402; EIA(M) Package: 1005; Voltage: 50V; ASSY: USED; Status: Active; Part Ref: R0402_40R2_1%; Current: *; Comment_1: *; RoHs: True; Power: 1/16W; Tolerance: 1%; Operating Temp: -50 to +155 C; Datasheet 1: ..\datasheet\Resistor\Yaego\Thick_Film\RC0402\2012-03-29; Manufacturer 2: Vishay Dale; Mfg Part Number 2: CRCW040240R2FKED; Datasheet 2: ..\datasheet\Resistor\Vishay Dale\CRC\2012-03-29
R31 = R0402_4k70_1%: Resistor, 4k7, 1/16W, 1%, -55 to +155 C, EIA0402; Manufacturer 1: Yageo; Mfg Part Number 1: RC0402FR-074k7L; EIA(I) Package: 0402; EIA(M) Package: 1005; Voltage: 50V; ASSY: USED; Status: Active; Part Ref: R0402_4k70_1%; Current: *; Comment_1: *; RoHs: True; Operating Temp: -55 to +155 C; Datasheet 1: ..\datasheet\Resistor\Yaego\Thick_Film\RC0402\2012-03-29; Manufacturer 2: Vishay Dale; Mfg Part Number 2: CRCW04024k70FKED; Datasheet 2: ..\datasheet\Resistor\Vishay Dale\CRC\2012-03-29
R32 = R0402_80R6_1%: as R5 on sheet DDR3A; Status: Active; Part Ref: R0402_80R6_1%; Current: *; Comment_1: *; RoHs: True; Operating Temp: -50 to +155 C; Datasheet 1: ..\datasheet\Resistor\Yaego\Thick_Film\RC0402\2012-03-29; Manufacturer 2: Vishay Dale; Mfg Part Number 2: CRCW040280R6FKED; Datasheet 2: ..\datasheet\Resistor\Vishay Dale\CRC\2012-03-29
R33 R34 = R0402_10k0_1%: Resistor, 10k0, 1/16W, 1%, -55 to +155 C, EIA0402; Manufacturer 1: Yageo; Mfg Part Number 1: RC0402FR-0710k0L; EIA(I) Package: 0402; EIA(M) Package: 1005; Voltage: 50V; ASSY: USED; Status: Active; Part Ref: R0402_10k0_1%; Current: *; Comment_1: *; RoHs: True; Package: 0402; Operating Temp: -55 to +155 C; Datasheet 1: ..\datasheet\Resistor\Yaego\Thick_Film\RC0402\2012-03-29; Manufacturer 2: Vishay Dale; Mfg Part Number 2: CRCW040210k0FKED; Datasheet 2: ..\datasheet\Resistor\Vishay Dale\CRC\2012-03-29
R36 = R0402_240R_1%: as R7 on sheet DDR3A; Status: Active; Part Ref: R0402_240R_1%; Current: *; Comment_1: *; RoHs: True; Operating Temp: -50 to +155 C
U3 = IS43TR16256A-125KBLI: as U2 on sheet DDR3A; PART NUMBER: IS43TR16256A-125KBLI; Part Ref: IS43TR16256A-125KBLI; Status: Active; RoHs: False; Value: IS43TR16256A-125KBLI; Mfg Part Number 1: IS43TR16256A-125KBLI
U4 = TPS51206: DDR Termination Regulator, -40 to +85 C; Manufacturer 1: Texas Instruments; Mfg Part Number 1: TPS51206DSQT; Voltage: 3.3V or 5V; Current: 2A; PART NUMBER: TPS51206; Part Ref: TPS51206; Status: Active; RoHs: True; Value: TPS51206; Operating Temp: -40 to +85 C

## Sheet Ethernet.SchDoc: 02290_Sonoma_Controller
size B; ApprovedBy: J Johnson; CheckedBy: J Johnson; Author: sdfasdfdfAEFfasdFfaF; DrawnBy: J Johnson; Organization: Opsero Electronic Design; Address1: 21-915 Av. Marguerite-Bourgeoys; Address2: Québec (QC); Address3: G1S 3X4; DocumentNumber: OP009-001-SCH; Revision: D-1; SheetNumber: 05; SheetTotal: 16; Tel1: (581) 308-8830; Tel2: (581) 308-8830; Project: 02290_Sonoma_Controller; CheckedDate: 2013-12-13; Sheet: Ethernet PHY; PageSetup: Record=PageOptions|CenterHorizontal=True|CenterVertical=True|PrintScale=1.08|XCorrection=1.00|YCorrection=1.00|PrintKind=0|BorderSize=5000000|LeftOffset=0|BottomOffset=0|Orientation=2|PaperLength=1000|PaperWidth=1000|Scale=100|PaperSource=7|PrintQuality=-4|MediaType=1|DitherType=10|PaperKind=Tabloid     [11 x 17 in]|PrintScaleMode=1; DrawDate: 2013-12-13; SchTitle: 02290_Sonoma_Controller; RevDescription: Replaced Q2,Q3 with STD16NF06LT4; RevDate: 2020-07-07; RevBy: J Johnson; RevDescription2: Added resistors to QSPI interface; ModifiedDate: 2020-07-07
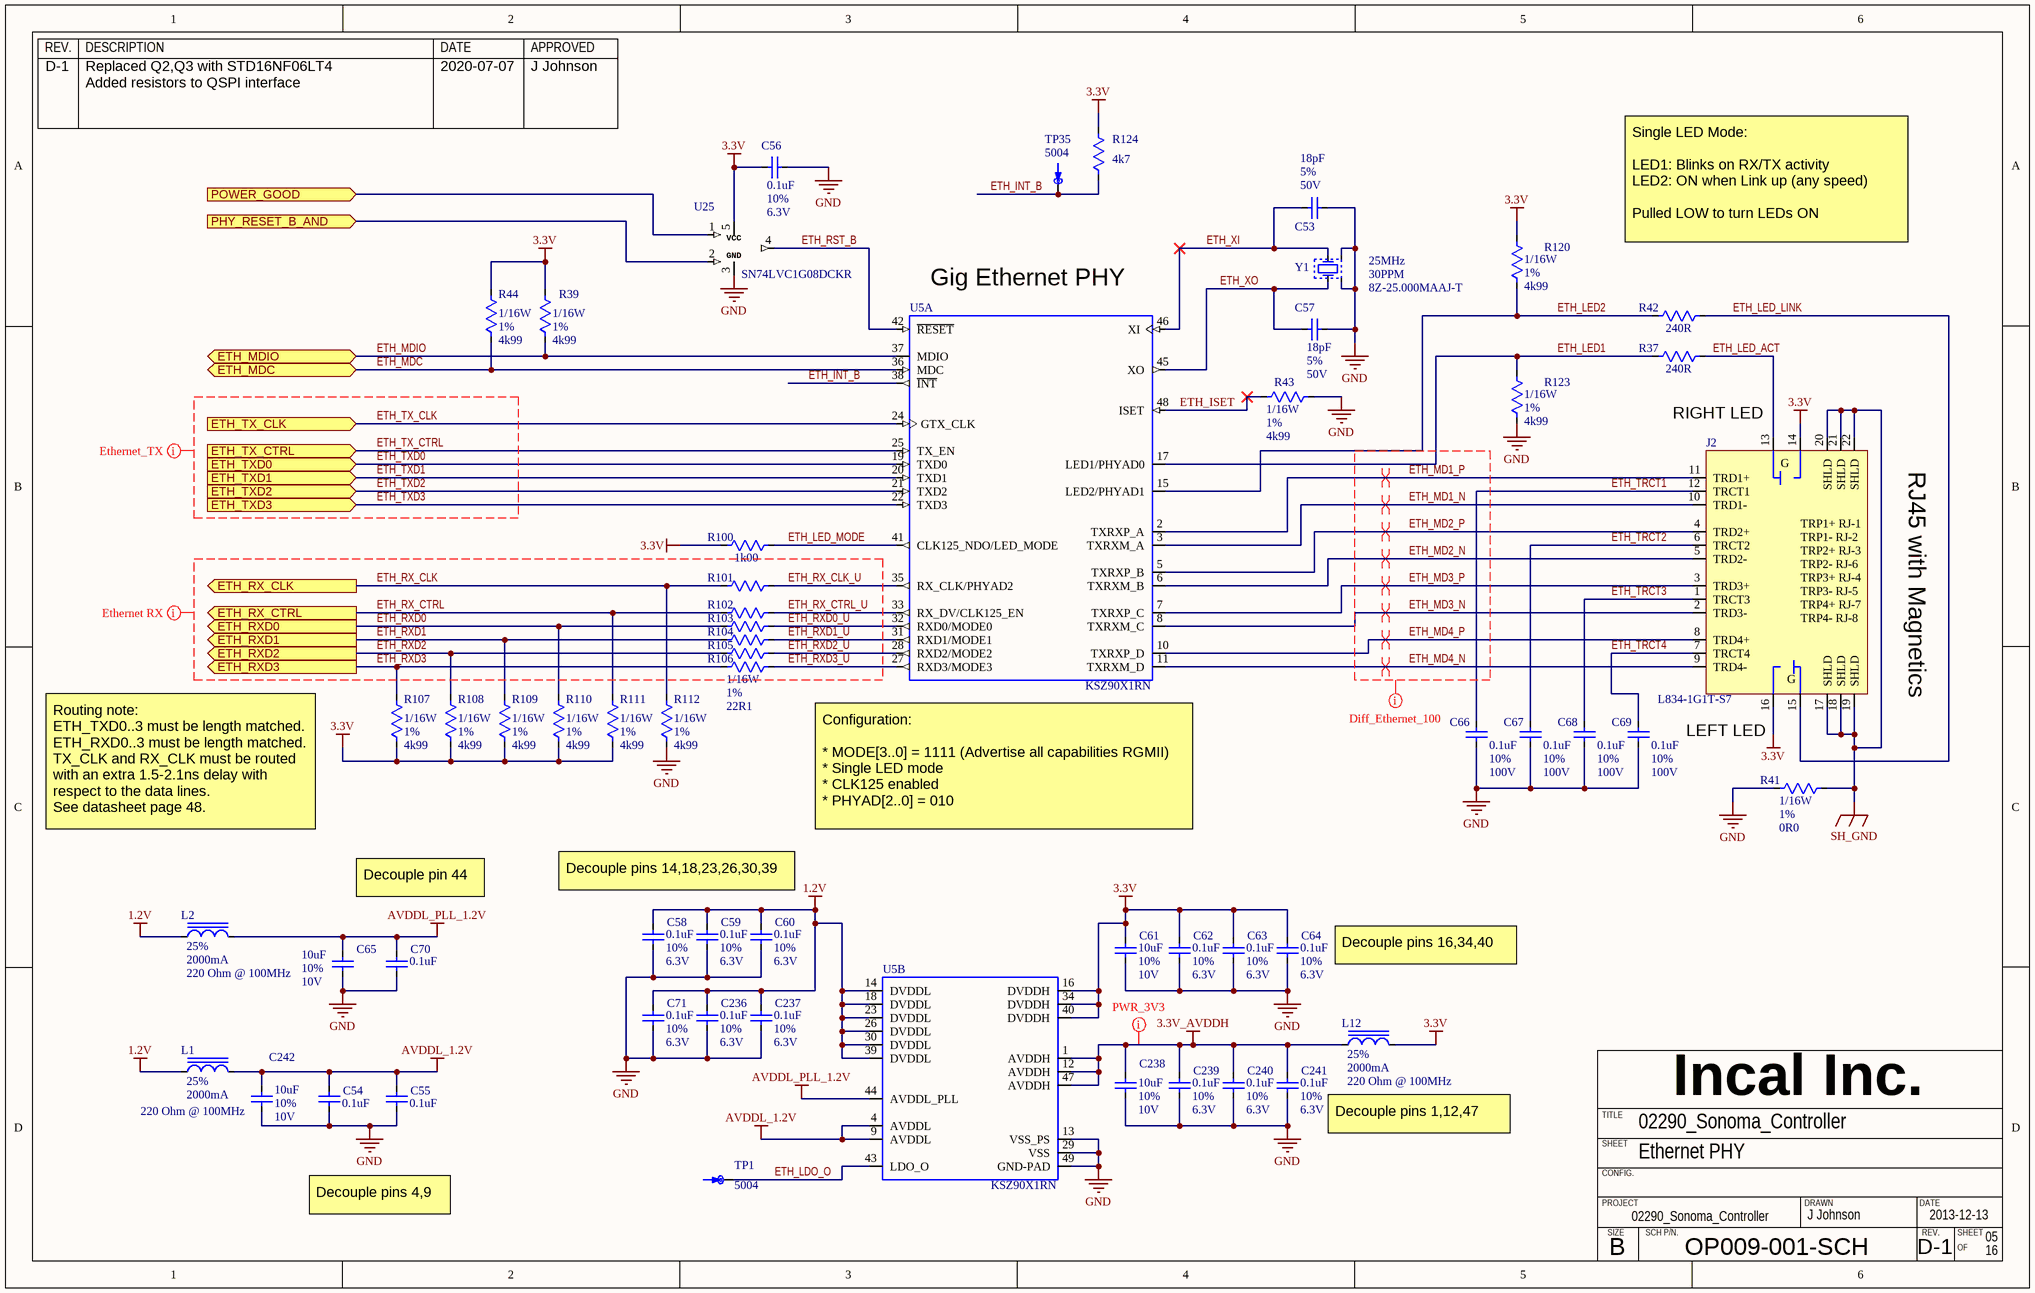
[diagram p7: Ethernet.SchDoc]

### Parts
C53  value 18pF  Tolerance: 5%  Voltage: 50V  [CAPC1005X33N]  (hidden comment: CAPACITOR_NP_TYPE1)
C54  value 0.1uF  [CAPC0603X33N]  (hidden comment: CAPACITOR_NP_TYPE1)
C55  value 0.1uF  [CAPC0603X33N]  (hidden comment: CAPACITOR_NP_TYPE1)
C56  value 0.1uF  Tolerance: 10%  Voltage: 6.3V  [CAPC0603X33N]  (hidden comment: CAPACITOR_NP_TYPE1)
C57  value 18pF  Tolerance: 5%  Voltage: 50V  [CAPC1005X33N]  (hidden comment: CAPACITOR_NP_TYPE1)
C58  value 0.1uF  Tolerance: 10%  Voltage: 6.3V  [CAPC0603X33N]  (hidden comment: CAPACITOR_NP_TYPE1)
C59  value 0.1uF  Tolerance: 10%  Voltage: 6.3V  [CAPC0603X33N]  (hidden comment: CAPACITOR_NP_TYPE1)
C60  value 0.1uF  Tolerance: 10%  Voltage: 6.3V  [CAPC0603X33N]  (hidden comment: CAPACITOR_NP_TYPE1)
C61  value 10uF  Tolerance: 10%  Voltage: 10V  [CAPC1608X38N]  (hidden comment: CAPACITOR_NP_TYPE1)
C62  value 0.1uF  Tolerance: 10%  Voltage: 6.3V  [CAPC0603X33N]  (hidden comment: CAPACITOR_NP_TYPE1)
C63  value 0.1uF  Tolerance: 10%  Voltage: 6.3V  [CAPC0603X33N]  (hidden comment: CAPACITOR_NP_TYPE1)
C64  value 0.1uF  Tolerance: 10%  Voltage: 6.3V  [CAPC0603X33N]  (hidden comment: CAPACITOR_NP_TYPE1)
C65  value 10uF  Tolerance: 10%  Voltage: 10V  [CAPC1608X38N]  (hidden comment: CAPACITOR_NP_TYPE1)
C66  value 0.1uF  Tolerance: 10%  Voltage: 100V  [CAPC1608X38N]  (hidden comment: CAPACITOR_NP_TYPE1)
C67  value 0.1uF  Tolerance: 10%  Voltage: 100V  [CAPC1608X38N]  (hidden comment: CAPACITOR_NP_TYPE1)
C68  value 0.1uF  Tolerance: 10%  Voltage: 100V  [CAPC1608X38N]  (hidden comment: CAPACITOR_NP_TYPE1)
C69  value 0.1uF  Tolerance: 10%  Voltage: 100V  [CAPC1608X38N]  (hidden comment: CAPACITOR_NP_TYPE1)
C70  value 0.1uF  [CAPC0603X33N]  (hidden comment: CAPACITOR_NP_TYPE1)
C71  value 0.1uF  Tolerance: 10%  Voltage: 6.3V  [CAPC0603X33N]  (hidden comment: CAPACITOR_NP_TYPE1)
C236  value 0.1uF  Tolerance: 10%  Voltage: 6.3V  [CAPC0603X33N]  (hidden comment: CAPACITOR_NP_TYPE1)
C237  value 0.1uF  Tolerance: 10%  Voltage: 6.3V  [CAPC0603X33N]  (hidden comment: CAPACITOR_NP_TYPE1)
C238  value 10uF  Tolerance: 10%  Voltage: 10V  [CAPC1608X38N]  (hidden comment: CAPACITOR_NP_TYPE1)
C239  value 0.1uF  Tolerance: 10%  Voltage: 6.3V  [CAPC0603X33N]  (hidden comment: CAPACITOR_NP_TYPE1)
C240  value 0.1uF  Tolerance: 10%  Voltage: 6.3V  [CAPC0603X33N]  (hidden comment: CAPACITOR_NP_TYPE1)
C241  value 0.1uF  Tolerance: 10%  Voltage: 6.3V  [CAPC0603X33N]  (hidden comment: CAPACITOR_NP_TYPE1)
C242  value 10uF  Tolerance: 10%  Voltage: 10V  [CAPC1608X38N]  (hidden comment: CAPACITOR_NP_TYPE1)
J2  value L834-1G1T-S7  [L834-1G1T-S7]  (hidden comment: CON_RJ45_MAG_TYPE_9)
L1  value 220 Ohm @ 100MHz  Tolerance: 25%  Current: 2000mA  [INDC2012X85N]  (hidden comment: INDUCTOR_CORE_TYPE1)
L2  value 220 Ohm @ 100MHz  Tolerance: 25%  Current: 2000mA  [INDC2012X85N]  (hidden comment: INDUCTOR_CORE_TYPE1)
L12  value 220 Ohm @ 100MHz  Tolerance: 25%  Current: 2000mA  [INDC2012X85N]  (hidden comment: INDUCTOR_CORE_TYPE1)
R37  value 240R  [RESC1005X33N]  (hidden comment: *)
R39  value 4k99  Power: 1/16W  Tolerance: 1%  [RESC1005X33N]  (hidden comment: *)
R41  value 0R0  Power: 1/16W  Tolerance: 1%  [RESC1005X33N]  (hidden comment: *)
R42  value 240R  [RESC1005X33N]  (hidden comment: *)
R43  value 4k99  Power: 1/16W  Tolerance: 1%  [RESC1005X33N]  (hidden comment: *)
R44  value 4k99  Power: 1/16W  Tolerance: 1%  [RESC1005X33N]  (hidden comment: *)
R100  value 1k00  [RESC1005X33N]  (hidden comment: *)
R101  *  [RESC1005X33N]  (value not drawn)
R102  *  [RESC1005X33N]  (value not drawn)
R103  *  [RESC1005X33N]  (value not drawn)
R104  *  [RESC1005X33N]  (value not drawn)
R105  *  [RESC1005X33N]  (value not drawn)
R106  value 22R1  Power: 1/16W  Tolerance: 1%  [RESC1005X33N]  (hidden comment: *)
R107  value 4k99  Power: 1/16W  Tolerance: 1%  [RESC1005X33N]  (hidden comment: *)
R108  value 4k99  Power: 1/16W  Tolerance: 1%  [RESC1005X33N]  (hidden comment: *)
R109  value 4k99  Power: 1/16W  Tolerance: 1%  [RESC1005X33N]  (hidden comment: *)
R110  value 4k99  Power: 1/16W  Tolerance: 1%  [RESC1005X33N]  (hidden comment: *)
R111  value 4k99  Power: 1/16W  Tolerance: 1%  [RESC1005X33N]  (hidden comment: *)
R112  value 4k99  Power: 1/16W  Tolerance: 1%  [RESC1005X33N]  (hidden comment: *)
R120  value 4k99  Power: 1/16W  Tolerance: 1%  [RESC1005X33N]  (hidden comment: *)
R123  value 4k99  Power: 1/16W  Tolerance: 1%  [RESC1005X33N]  (hidden comment: *)
R124  value 4k7  [RESC1005X33N]  (hidden comment: *)
TP1  value 5004  [KEY_5004]  (hidden comment: TEST_POINT_TYPE4)
TP35  value 5004  [KEY_5004]  (hidden comment: TEST_POINT_TYPE4)
U5  KSZ90X1RN  [QFN50P700X700X90-49N]  (value not drawn)  (parts A,B of 2)
U25  value SN74LVC1G08DCKR  [SOT65P210X110-5N]  (hidden comment: SN74LVC1G08)
Y1  value 25MHz  Tolerance: 30PPM  Mfg Part Number 1: 8Z-25.000MAAJ-T  [OSCSC185P200X250X55-4N]  (hidden comment: *)

### Ports
ETH_MDC (bidir), ETH_MDIO (bidir), ETH_RX_CLK (out), ETH_RX_CTRL (out), ETH_RXD0 (out), ETH_RXD1 (out), ETH_RXD2 (out), ETH_RXD3 (out), ETH_TX_CLK (in), ETH_TX_CTRL (in), ETH_TXD0 (in), ETH_TXD1 (in), ETH_TXD2 (in), ETH_TXD3 (in), PHY_RESET_B_AND (in), POWER_GOOD (in)

### Nets
1.2V: C58.1 C59.1 C60.1 C71.1 C236.1 C237.1 L1.1 L2.1 U5.14(DVDDL) U5.18(DVDDL) U5.23(DVDDL) U5.26(DVDDL) U5.30(DVDDL) U5.39(DVDDL)
3.3V: C56.1 C61.1 C62.1 C63.1 C64.1 J2.14(A2) J2.16(A1) L12.2 R39.2 R44.2 R100.1 R107.1 R108.1 R109.1 R110.1 R111.1 R120.2 R124.1 U5.16(DVDDH) U5.34(DVDDH) U5.40(DVDDH) U25.5(VCC)
3.3V_AVDDH: C238.1 C239.1 C240.1 C241.1 L12.1 U5.1(AVDDH) U5.12(AVDDH) U5.47(AVDDH)
AVDDL_1.2V: C54.1 C55.1 C242.1 L1.2 U5.4(AVDDL) U5.9(AVDDL)
AVDDL_PLL_1.2V: C65.1 C70.1 L2.2 U5.44(AVDDL_PLL)
GND: C53.2 C54.2 C55.2 C56.2 C57.2 C58.2 C59.2 C60.2 C61.2 C62.2 C63.2 C64.2 C65.2 C66.2 C67.2 C68.2 C69.2 C70.2 C71.2 C236.2 C237.2 C238.2 C239.2 C240.2 C241.2 C242.2 R41.1 R43.1 R112.1 R123.1 U5.13(VSS_PS) U5.29(VSS) U5.49(GND-PAD) U25.3(GND) Y1.2 Y1.4
SH_GND: J2.17(SHLD) J2.18(SHLD) J2.19(SHLD) J2.20(SHLD) J2.21(SHLD) J2.22(SHLD) R41.2
ETH_INT_B: R124.2 TP35.1 U5.38(~{INT})
ETH_ISET: R43.2 U5.48(ISET)
ETH_LDO_O: TP1.1 U5.43(LDO_O)
ETH_LED1: R37.1 R123.2 U5.17(LED1/PHYAD0)
ETH_LED2: R42.1 R120.1 U5.15(LED2/PHYAD1)
ETH_LED_ACT: J2.13(K2) R37.2
ETH_LED_LINK: J2.15 R42.2
ETH_LED_MODE: R100.2 U5.41(CLK125_NDO/LED_MODE)
ETH_MD1_N: J2.10(TRD1-) U5.3(TXRXM_A)
ETH_MD1_P: J2.11(TRD1+) U5.2(TXRXP_A)
ETH_MD2_N: J2.5(TRD2-) U5.6(TXRXM_B)
ETH_MD2_P: J2.4(TRD2+) U5.5(TXRXP_B)
ETH_MD3_N: J2.2(TRD3-) U5.8(TXRXM_C)
ETH_MD3_P: J2.3(TRD3+) U5.7(TXRXP_C)
ETH_MD4_N: J2.9(TRD4-) U5.11(TXRXM_D)
ETH_MD4_P: J2.8(TRD4+) U5.10(TXRXP_D)
ETH_MDC: R44.1 U5.36(MDC) ; port ETH_MDC
ETH_MDIO: R39.1 U5.37(MDIO) ; port ETH_MDIO
ETH_RST_B: U5.42(~{RESET}) U25.4(Y)
ETH_RX_CLK: R101.1 R112.2 ; port ETH_RX_CLK
ETH_RX_CLK_U: R101.2 U5.35(RX_CLK/PHYAD2)
ETH_RX_CTRL: R102.1 R111.2 ; port ETH_RX_CTRL
ETH_RX_CTRL_U: R102.2 U5.33(RX_DV/CLK125_EN)
ETH_RXD0: R103.1 R110.2 ; port ETH_RXD0
ETH_RXD0_U: R103.2 U5.32(RXD0/MODE0)
ETH_RXD1: R104.1 R109.2 ; port ETH_RXD1
ETH_RXD1_U: R104.2 U5.31(RXD1/MODE1)
ETH_RXD2: R105.1 R108.2 ; port ETH_RXD2
ETH_RXD2_U: R105.2 U5.28(RXD2/MODE2)
ETH_RXD3: R106.1 R107.2 ; port ETH_RXD3
ETH_RXD3_U: R106.2 U5.27(RXD3/MODE3)
ETH_TRCT1: C66.1 J2.12(TRCT1)
ETH_TRCT2: C67.1 J2.6(TRCT2)
ETH_TRCT3: C68.1 J2.1(TRCT3)
ETH_TRCT4: C69.1 J2.7(TRCT4)
ETH_TX_CLK: U5.24(GTX_CLK) ; port ETH_TX_CLK
ETH_TX_CTRL: U5.25(TX_EN) ; port ETH_TX_CTRL
ETH_TXD0: U5.19(TXD0) ; port ETH_TXD0
ETH_TXD1: U5.20(TXD1) ; port ETH_TXD1
ETH_TXD2: U5.21(TXD2) ; port ETH_TXD2
ETH_TXD3: U5.22(TXD3) ; port ETH_TXD3
ETH_XI: C53.1 U5.46(XI) Y1.3
ETH_XO: C57.1 U5.45(XO) Y1.1
PHY_RESET_B_AND: U25.2(B) ; port PHY_RESET_B_AND
POWER_GOOD: U25.1(A) ; port POWER_GOOD

### Layout directives
differential pair: ETH_MD1_N, ETH_MD1_P, ETH_MD2_N, ETH_MD2_P, ETH_MD3_N, ETH_MD3_P, ETH_MD4_N, ETH_MD4_P
net class Power_3V3: 3.3V_AVDDH
net class Ethernet_TX: ETH_TX_CLK, ETH_TX_CTRL, ETH_TXD0, ETH_TXD1, ETH_TXD2, ETH_TXD3
net class Ethernet RX: ETH_RX_CLK, ETH_RX_CLK_U, ETH_RX_CTRL, ETH_RX_CTRL_U, ETH_RXD0, ETH_RXD0_U, ETH_RXD1, ETH_RXD1_U, ETH_RXD2, ETH_RXD2_U, ETH_RXD3, ETH_RXD3_U
net class Diff_Ethernet_100: ETH_MD1_N, ETH_MD1_P, ETH_MD2_N, ETH_MD2_P, ETH_MD3_N, ETH_MD3_P, ETH_MD4_N, ETH_MD4_P

### Notes on the sheet
- Single LED Mode:
  LED1: Blinks on RX/TX activity
  LED2: ON when Link up (any speed)
  Pulled LOW to turn LEDs ON
- (near U5) Gig Ethernet PHY
- (near J2) RIGHT LED
- (near J2) RJ45 with Magnetics
- (near J2) LEFT LED
- Routing note:
  ETH_TXD0..3 must be length matched.
  ETH_RXD0..3 must be length matched.
  TX_CLK and RX_CLK must be routed with an extra 1.5-2.1ns delay with respect to the data lines.
  See datasheet page 48.
- (near U5) Configuration:
  * MODE[3..0] = 1111 (Advertise all capabilities RGMII)
  * Single LED mode
  * CLK125 enabled
  * PHYAD[2..0] = 010
- Decouple pin 44
- Decouple pins 14,18,23,26,30,39
- (near C64) Decouple pins 16,34,40
- Decouple pins 1,12,47
- Decouple pins 4,9
- REV.
- DESCRIPTION
- DATE
- APPROVED
- Incal Inc.
- SHEET
- TITLE
- CONFIG.
- PROJECT
- SIZE
- SCH P/N.
- DRAWN
- B
- OF
- (in symbol L834-1G1T-S7) G; TRP1+ RJ-1; TRP1- RJ-2; TRP2+ RJ-3; TRP2- RJ-6; TRP3+ RJ-4; TRP3- RJ-5; TRP4+ RJ-7; TRP4- RJ-8

### Library data of the parts
C53 C57 = C0402_18pF_5%_50V_C0G: Capacitor ceramic, C0G (NP0), 18pF, 50V, 5%, -55 to +125 C, EIA0402; Manufacturer 1: Murata; Mfg Part Number 1: GRM1555C1H180JZ01D; EIA(I) Package: 0402; EIA(M) Package: 1005; ASSY: USED; Status: Active; Power: *; Current: *; Part Ref: C0402_18pF_5%_50V_C0G; Comment_1: *; RoHs: True; Operating Temp: -55 to +125 C; Datasheet 1: ..\datasheet\Capacitor\Murata\GRM_Serie\Series catalog\2013-04-30
C54-C56 C58-C60 C62-C64 C70 C71 C236 C237 C239-C241 = C0201_0.1uF_10%_6.3V_X5R: as C2-C5 on sheet DDR3A; Status: Active; Power: *; Current: *; Part Ref: C0201_0.1uF_10%_6.3V_X5R; Comment_1: *; RoHs: True; Operating Temp: -55 to +85 C
  C54 C55 C70: Tolerance: 10%; Voltage: 6.3V
C61 C65 C238 C242 = C0603_10uF_10%_10V_X5R: as C42 on sheet DDR3B; Status: Active; Power: *; Current: *; Part Ref: C0603_10uF_10%_10V_X5R; Comment_1: *; RoHs: True; Operating Temp: -55 to +85 C
C66-C69 = C0603_0.1uF_10%_100V_X7R: Capacitor ceramic, X7R, 0.1uF, 100V, 10%, -55 to +125 C, EIA0603; Manufacturer 1: Murata; Mfg Part Number 1: GRM188R72A104KA35D; EIA(I) Package: 0603; EIA(M) Package: 1608; ASSY: USED; Status: Active; Power: *; Current: *; Part Ref: C0603_0.1uF_10%_100V_X7R; Comment_1: *; RoHs: True; Operating Temp: -55 to +125 C; Datasheet 1: ..\datasheet\Capacitor\Murata\GRM_Serie\GRM188R72A_X7R\2012-06-24
J2 = L834-1G1T-S7: Connector RJ45, 10/100/1000, with Mag & 2 LED G/G, Tab down; Manufacturer 1: Bel Fuse; Status: Active; EIA(I) Package: *; EIA(M) Package: *; Part Ref: L834-1G1T-S7; Tolerance: *; Package: *; RoHs: True; Datasheet 1: https://www.belfuse.com/resources/ICMs/ICMs%20Drawings/L834-1G1T-S7.pdf; Mfg Part Number 1: L834-1G1T-S7; Operating Temp: -
L1 L2 L12 = BLM21PG221SN1D: Ferrite chip, 220 Ohm @ 100MHz, 2000mA, 25%, -55 to +125 C, 0805; Manufacturer 1: Murata; EIA(I) Package: 0805; EIA(M) Package: 2012; ASSY: USED; Status: Active; Power: *; Part Ref: BLM21PG221SN1D; Voltage: *; Comment_1: *; RoHs: True; Operating Temp: -55 to +125 C; Mfg Part Number 1: BLM21PG221SN1D
R37 R42 = R0402_240R_1%: as R7 on sheet DDR3A; Status: Active; Part Ref: R0402_240R_1%; Current: *; Comment_1: *; RoHs: True; Power: 1/16W; Tolerance: 1%; Operating Temp: -50 to +155 C
R39 R43 R44 R107-R112 R120 R123 = R0402_4k99_1%: Resistor, 4k99, 1/16W, 1%, -50 to +155 C, EIA0402, EIA(M)1005; Manufacturer 1: Yageo; Mfg Part Number 1: RC0402FR-074k99L; EIA(I) Package: 0402; EIA(M) Package: 1005; Voltage: 50V; ASSY: USED; Status: Active; Part Ref: R0402_4k99_1%; Current: *; Comment_1: *; RoHs: True; Operating Temp: -50 to +155 C; Datasheet 1: ..\datasheet\Resistor\Yaego\Thick_Film\RC0402\2012-03-29; Manufacturer 2: Vishay Dale; Mfg Part Number 2: CRCW04024k99FKED; Datasheet 2: ..\datasheet\Resistor\Vishay Dale\CRC\2012-03-29
R41 = R0402_0R0_1%: Resistor, 0R0, 1/16W, 1%, -50 to +155 C, EIA0402, EIA(M)1005; Manufacturer 1: Yageo; Mfg Part Number 1: RC0402FR-070RL; EIA(I) Package: 0402; EIA(M) Package: 1005; Voltage: 50V; ASSY: USED; Status: Active; Part Ref: R0402_0R0_1%; Current: *; Comment_1: *; RoHs: True; Package: 0402; Operating Temp: -50 to +155 C; Datasheet 1: ..\datasheet\Resistor\Yaego\Thick_Film\RC0402\2012-03-29; Manufacturer 2: Rohm Semiconductor; Mfg Part Number 2: MCR01MRTJ000; Datasheet 2: ..\datasheet\Resistor\Rohm\2012-08-20
R100 = R0402_1k00_1%: Resistor, 1k00, 1/16W, 1%, -55 to +155 C, EIA0402; Manufacturer 1: Yageo; Mfg Part Number 1: RC0402FR-071K00L; EIA(I) Package: 0402; EIA(M) Package: 1005; Voltage: 50V; ASSY: USED; Status: Active; Part Ref: R0402_1k00_1%; Current: *; Comment_1: *; RoHs: True; Power: 1/16W; Tolerance: 1%; Operating Temp: -55 to +155 C; Datasheet 1: ..\datasheet\Resistor\Yaego\Thick_Film\RC0402\2012-03-29; Manufacturer 2: Vishay Dale; Mfg Part Number 2: CRCW04021k00FKED; Datasheet 2: ..\datasheet\Resistor\Vishay Dale\CRC\2012-03-29
R101-R106 = R0402_22R1_1%: Resistor, 22R1, 1/16W, 1%, -55 to +155 C, EIA0402; Manufacturer 1: Yageo; Mfg Part Number 1: RC0402FR-0722R1L; EIA(I) Package: 0402; EIA(M) Package: 1005; Voltage: 50V; ASSY: USED; Status: Active; Part Ref: R0402_22R1_1%; Current: *; Comment_1: *; RoHs: True; Operating Temp: -55 to +155 C; Datasheet 1: ..\datasheet\Resistor\Yaego\Thick_Film\RC0402\2012-03-29; Manufacturer 2: Vishay Dale; Mfg Part Number 2: CRCW040222R1FKED; Datasheet 2: ..\datasheet\Resistor\Vishay Dale\CRC\2012-03-29
  R101-R105: Power: 1/16W; Tolerance: 1%; Value: 22R1
R124 = R0402_4k70_1%: as R31 on sheet DDR3B; Status: Active; Part Ref: R0402_4k70_1%; Current: *; Comment_1: *; RoHs: True; Power: 1/16W; Tolerance: 1%; Operating Temp: -55 to +155 C; Datasheet 1: ..\datasheet\Resistor\Yaego\Thick_Film\RC0402\2012-03-29; Manufacturer 2: Vishay Dale; Mfg Part Number 2: CRCW04024k70FKED; Datasheet 2: ..\datasheet\Resistor\Vishay Dale\CRC\2012-03-29
TP1 TP35 = 5004: Test point bead, yellow, Keystone Electronics, Thru-hole,; Manufacturer 1: Keystone inc; ASSY: USED; Power: Pow; Current: Cur; Voltage: Vol; Comment_1: Com; Status: Active; EIA(I) Package: *; EIA(M) Package: *; Part Ref: 5004; Tolerance: *; Package: *; RoHs: True; Mfg Part Number 1: 5004; Datasheet 1: ..\datasheet\Connector\Keystone Electronics\5001-5014\2012-06-28
U5 = KSZ9021RNI: 10/100/1000 ethernet PHY with RGMII, 3.3V,1.2V, 0, -40 to +85 C, 0, QFN48; Manufacturer 1: Micrel; ASSY: USED; Power: 0; Status: Active; EIA(I) Package: *; EIA(M) Package: *; Part Ref: KSZ9021RNI; Current: 0; Tolerance: *; Voltage: 3.3V,1.2V; Package: QFN48; RoHs: True; Value: KSZ9021RNI; Operating Temp: -40 to +85 C; Mfg Part Number 1: KSZ9021RNI; Datasheet 1: ..\datasheet\Interface\KSZ9031RNX\2012-10-18; Manufacturer 2: MICREL; Mfg Part Number 2: KSZ9021RNI; Datasheet 2: ..\datasheet\Interface\KSZ9021RN\2012-10-18
U25 = SN74LVC1G08DCKR: Single 2-input AND gate, 1.65V to 5.5V; Manufacturer 1: Texas Instruments; ASSY: USED; Power: Pow; Current: Cur; Comment_1: Com; Status: Active; EIA(I) Package: *; EIA(M) Package: *; Part Ref: SN74LVC1G08DCKR; Tolerance: *; Voltage: 1.65V to 5.5V; Package: SC70-5; RoHs: True; Operating Temp: -40 to 125 C; Mfg Part Number 1: SN74LVC1G08DCKR
Y1 = 8Z-25.000MAAJ-T: Crystal, 25MHz, 30ppm, 100uW, -40 to +85 C, SMT; Manufacturer 1: TXC; ASSY: USED; Status: Active; EIA(I) Package: *; EIA(M) Package: *; Part Ref: 8Z-25.000MAAJ-T; Voltage: *; Current: *; Power: 100uW; Comment_1: *; RoHs: True; Package: 2.0x2.5x0.55mm; Operating Temp: -40 to +85 C